# EAGLE schematic sensori di linea soccer 2018 (EAGLE 8.5.2)
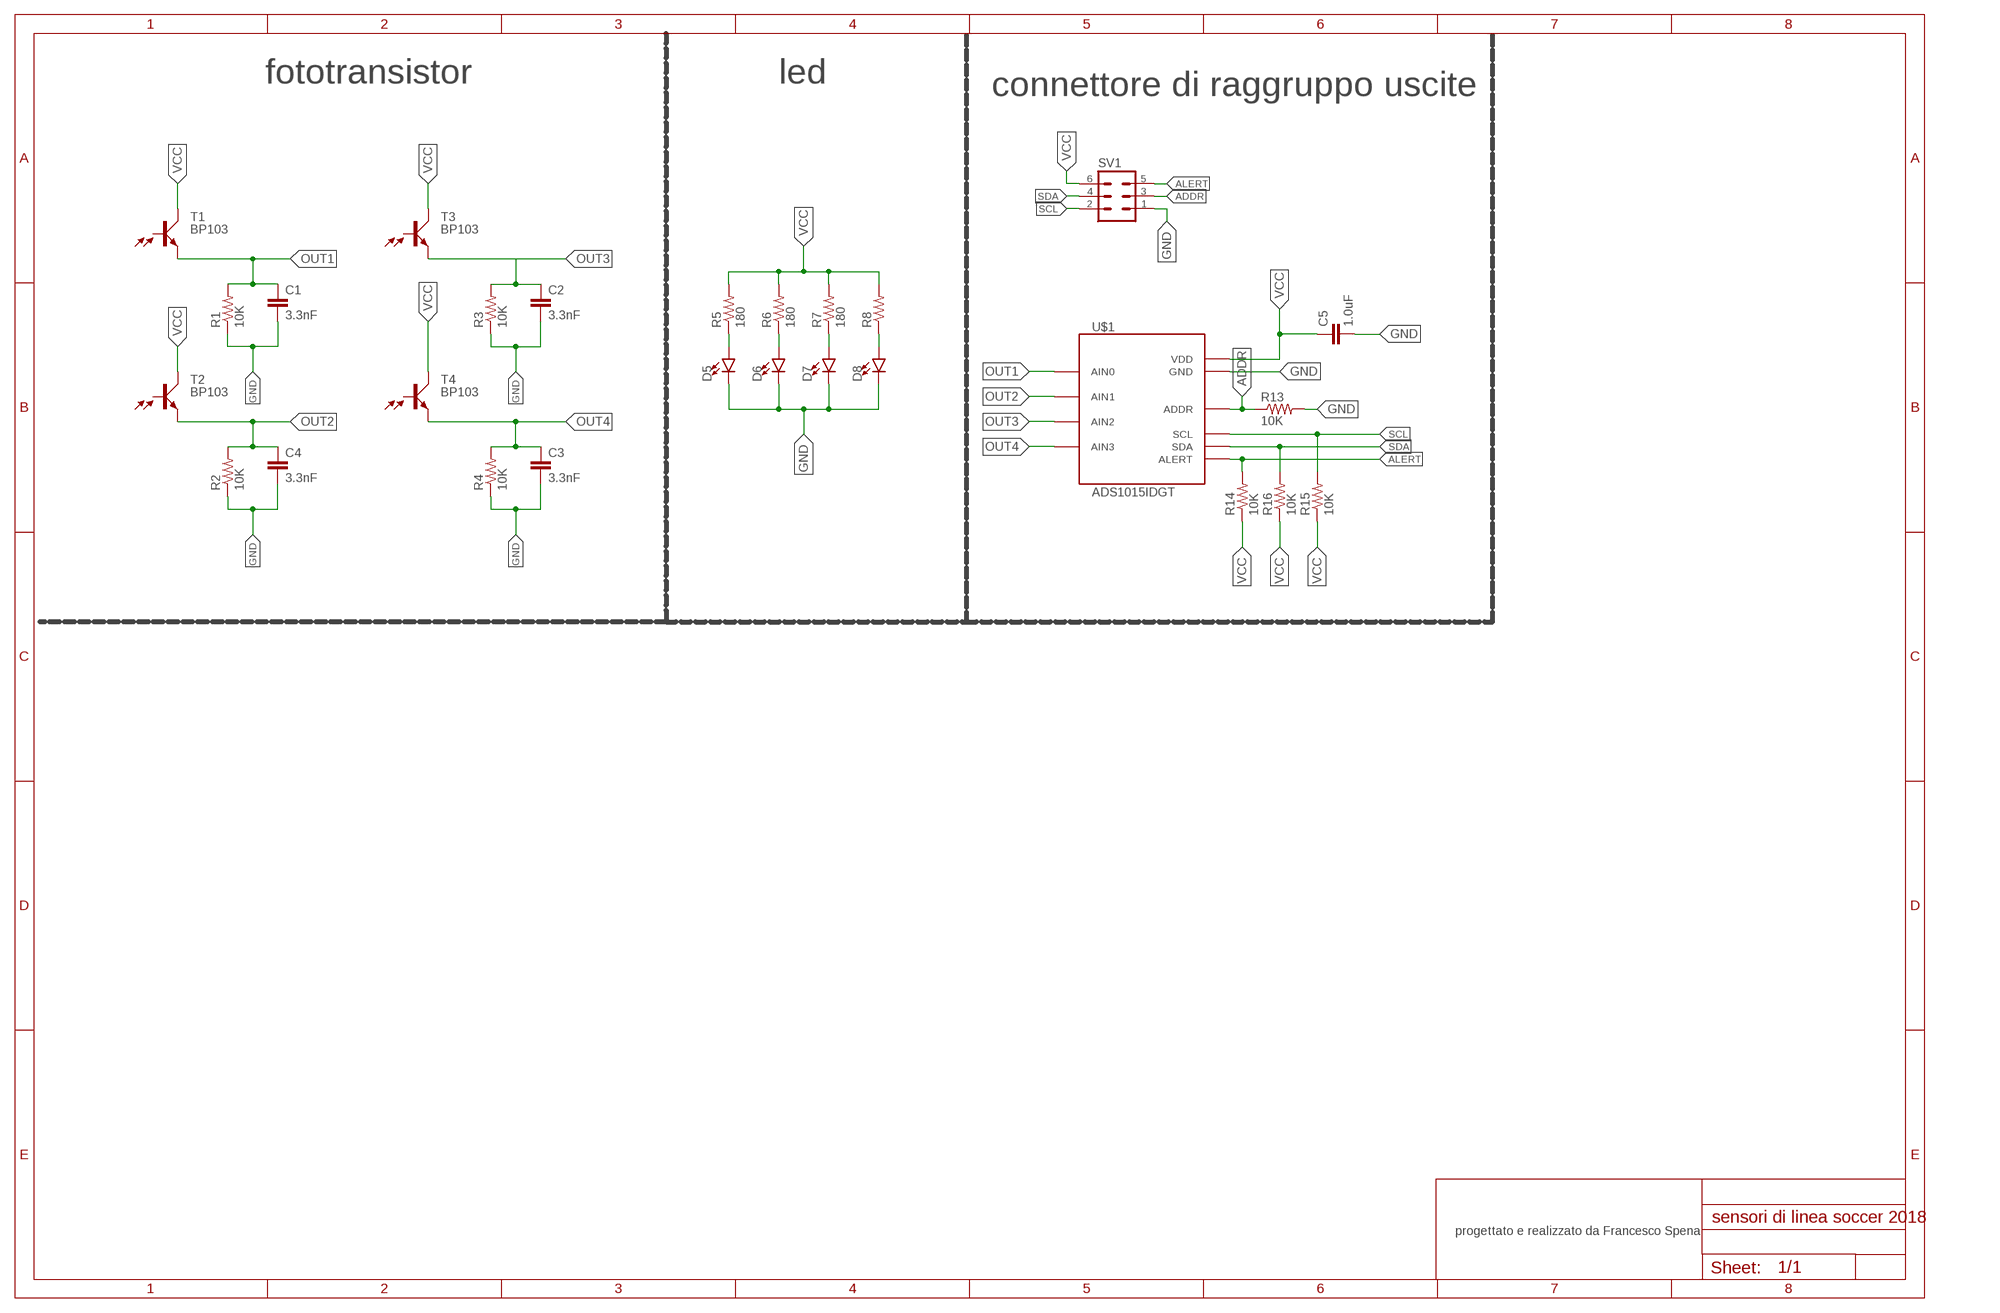
[diagram p0: schematic, sheet 1]

## Parts
C1  3.3nF  3.3NF-0603-100V-10%  [0603]
C2  3.3nF  3.3NF-0603-100V-10%  [0603]
C3  3.3nF  3.3NF-0603-100V-10%  [0603]
C4  3.3nF  3.3NF-0603-100V-10%  [0603]
C5  1.0uF  1.0UF-0402-16V-10%  [0402]
D5  LED3MM  [LED_3MM]
D6  LED3MM  [LED_3MM]
D7  LED3MM  [LED_3MM]
D8  LED3MM  [LED_3MM]
R1  10K  R-US_0204/7  [0204/7]
R2  10K  R-US_0204/7  [0204/7]
R3  10K  R-US_0204/7  [0204/7]
R4  10K  R-US_0204/7  [0204/7]
R5  180  R-US_0204/7  [0204/7]
R6  180  R-US_0204/7  [0204/7]
R7  180  R-US_0204/7  [0204/7]
R8  R-US_0204/7  [0204/7]
R13  10K  R-US_0204/7  [0204/7]
R14  10K  R-US_0204/7  [0204/7]
R15  10K  R-US_0204/7  [0204/7]
R16  10K  R-US_0204/7  [0204/7]
SV1  MA03-2  [MA03-2]
T1  BP103  [BP103]
T2  BP103  [BP103]
T3  BP103  [BP103]
T4  BP103  [BP103]
U$1  ADS1015IDGT  [MSOP10_0.5]

## Nets
ADDR: R13.1 SV1.3 U$1.1(ADDR)
ALERT: R14.2 SV1.5 U$1.2(ALERT)
GND: C1.2 C2.2 C3.2 C4.2 C5.2 D5.K(C) D6.K(C) D7.K(C) D8.K(C) R1.1 R2.1 R3.1 R4.1 R13.2 SV1.1 U$1.3(GND)
N$2: D5.A R5.1
N$3: D6.A R6.1
N$4: D7.A R7.1
N$5: D8.A R8.1
OUT1: C1.1 R1.2 T1.E U$1.4(AIN0)
OUT2: C4.1 R2.2 T2.E U$1.5(AIN1)
OUT3: C2.1 R3.2 T3.E U$1.6(AIN2)
OUT4: C3.1 R4.2 T4.E U$1.7(AIN3)
SCL: R15.2 SV1.2 U$1.10(SCL)
SDA: R16.2 SV1.4 U$1.9(SDA)
VCC: C5.1 R5.2 R6.2 R7.2 R8.2 R14.1 R15.1 R16.1 SV1.6 T1.C T2.C T3.C T4.C U$1.8(VDD)
Unconnected: T1.B T2.B T3.B T4.B

## Notes on the sheet
- fototransistor | led
- connettore di raggruppo uscite
- progettato e realizzato da Francesco Spena

## Library data of the parts
C1-C4 = SparkFun-Capacitors:3.3NF: 3.3nF ceramic capacitors A capacitor is a passive two-terminal electrical component used to store electrical energy temporarily in an electric field.; PROD_ID: CAP-09633
C5 = SparkFun-Capacitors:1.0UF: 1µF ceramic capacitors A capacitor is a passive two-terminal electrical component used to store electrical energy temporarily in an electric field.; PROD_ID: CAP-12417
D5-D8 = SparkFun-LED:LED: LED (Generic) Standard schematic elements and footprints for 5mm, 3mm, 1206, and 0603 sized LEDs. Generic LEDs with no color specified.; PROD_ID: DIO-08794
R1-R4 R13-R16 = resistor:R-US_: RESISTOR, American symbol
R5-R8 = rcl:R-US_: RESISTOR, American symbol
SV1 = con-lstb:MA03-2: PIN HEADER; OC_FARNELL: unknown; OC_NEWARK: unknown
T1-T4 = opto-trans-siemens:BP103: PHOTO TRANSISTOR; OC_FARNELL: unknown; OC_NEWARK: unknown
U$1 = bt_adc:ADS1015: Ti ADS1015 12-bit ADC Ultra-Small, Low-Power, 12-Bit Analog-to-Digital Converter with Internal Reference The ADS1013, ADS1014, and ADS1015 are precision analog-to-digital converters (ADCs) with 12 bits of resolution offered in an ultra-small, leadless QFN-10 package or an MSOP-10 package. \ Source: http://focus.ti.com/docs/prod/folders/print/ads1015.html